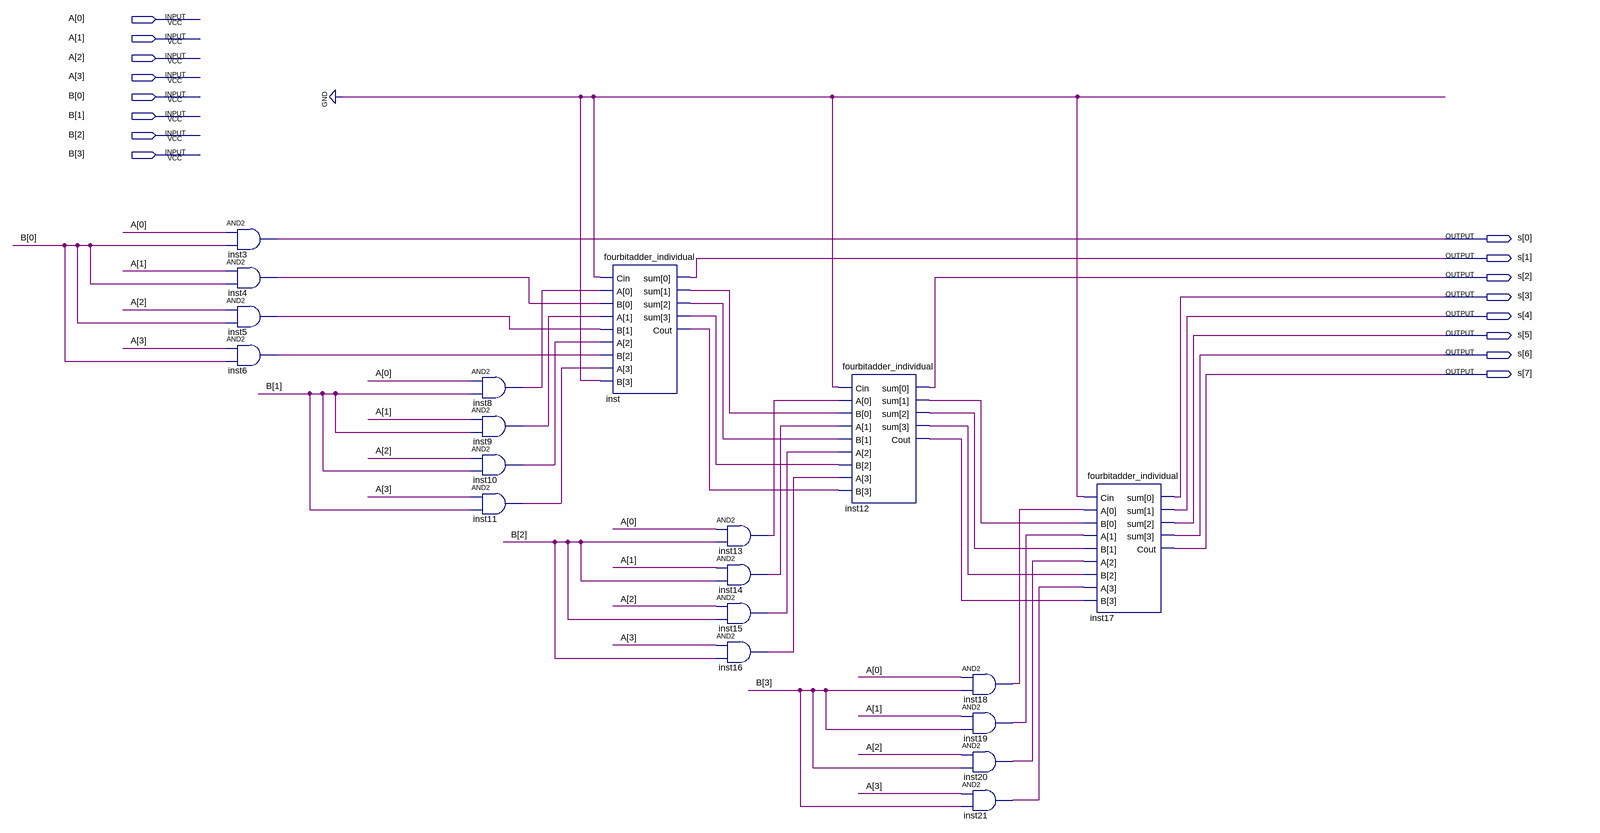
[diagram p0: schematic sheet]
// Quartus schematic multiplier.bdf as structural Verilog: 19 symbols, 16 pins
module multiplier (
  input  [3:0] A,
  input  [3:0] B,
  output [7:0] s
);

  wire inst4_out, inst5_out, inst6_out, inst8_out, inst9_out, inst10_out, inst11_out, inst12_cout,
       inst12_sum, inst12_sum_2, inst12_sum_3, inst13_out, inst14_out, inst15_out, inst16_out, inst18_out,
       inst19_out, inst20_out, inst21_out, inst_cout, inst_sum, inst_sum_2, inst_sum_3;

  and inst3 (s[0], A[0], B[0]);
  and inst4 (inst4_out, A[1], B[0]);
  and inst5 (inst5_out, A[2], B[0]);
  and inst6 (inst6_out, A[3], B[0]);
  and inst8 (inst8_out, A[0], B[1]);
  and inst9 (inst9_out, A[1], B[1]);
  and inst10 (inst10_out, A[2], B[1]);
  and inst11 (inst11_out, A[3], B[1]);
  fourbitadder_individual inst (
    .Cin(1'b0), .A({inst11_out, inst10_out, inst9_out, inst8_out}),
    .B({1'b0, inst6_out, inst5_out, inst4_out}), .sum({inst_sum_3, inst_sum_2, inst_sum, s[1]}),
    .Cout(inst_cout));
  and inst13 (inst13_out, A[0], B[2]);
  and inst14 (inst14_out, A[1], B[2]);
  and inst15 (inst15_out, A[2], B[2]);
  and inst16 (inst16_out, A[3], B[2]);
  fourbitadder_individual inst12 (
    .Cin(1'b0), .A({inst16_out, inst15_out, inst14_out, inst13_out}),
    .B({inst_cout, inst_sum_3, inst_sum_2, inst_sum}), .sum({inst12_sum_3, inst12_sum_2, inst12_sum, s[2]}),
    .Cout(inst12_cout));
  and inst18 (inst18_out, A[0], B[3]);
  and inst19 (inst19_out, A[1], B[3]);
  and inst20 (inst20_out, A[2], B[3]);
  and inst21 (inst21_out, A[3], B[3]);
  fourbitadder_individual inst17 (
    .Cin(1'b0), .A({inst21_out, inst20_out, inst19_out, inst18_out}),
    .B({inst12_cout, inst12_sum_3, inst12_sum_2, inst12_sum}), .sum(s[6:3]), .Cout(s[7]));
endmodule
